# Altium project Face_HM1V0.PrjPCB
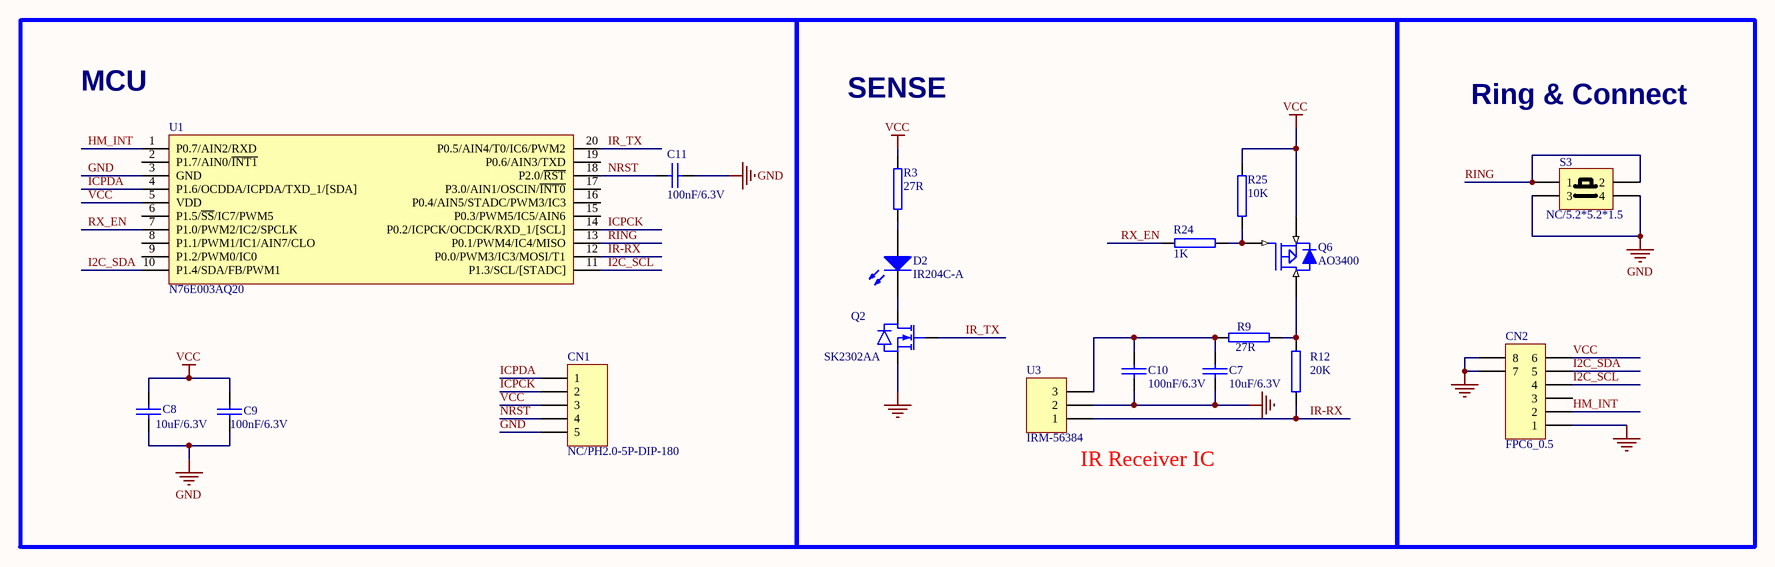
[diagram p0: Face_HM1V0.SchDoc]
1 sheet, 18 parts. Net scope: global (net labels, ports and power ports of the same name join across sheets).
Board file: Face_HM1V0.PcbDoc

## Sheet Face_HM1V0.SchDoc
size A3

### Parts
C7  10uf ±10% 6.3V X7R 0603 ROSH ROHS  [C0603]  (value not drawn)
C8  10uf ±10% 6.3V X7R 0603 ROSH ROHS  [C0603]  (value not drawn)
C9  100nF/6.3V 10% 0402 X7R ROHS  [C0402]  (value not drawn)
C10  100nF/6.3V 10% 0402 X7R ROHS  [C0402]  (value not drawn)
C11  100nF/6.3V 10% 0402 X7R ROHS  [C0402]  (value not drawn)
CN1  name1: NC/PH2.0-5P-DIP-180  [HD2.0_5P]  (hidden comment: NC/Header)
CN2  FPC6_0.5  [FPC0.5_6P_STRAIGHT]
D2  IR204C-A  [LD5.0_1 - duplicate]
Q2  SK2302AA  [SOT-23-3]
Q6  AO3400  [SOT-23-3]
R3  27R 5% 1/16W 0402 ROHS  [R0402]  (value not drawn)
R9  27R 5% 1/16W 0402 ROHS  [R0402]  (value not drawn)
R12  20K 5% 1/16W 0402 ROHS  [R0402]  (value not drawn)
R24  1K 5% 1/16W 0402 ROHS  [R0402]  (value not drawn)
R25  10K 5% 1/16W 0402 ROHS  [R0402]  (value not drawn)
S3  NC/5.2*5.2*1.5  [5.2X5.2X1.5 TACT SWITCH]
U1  N76E003AQ20(QFN20)  [QFN20_3*3mm]  (value not drawn)
U3  IRM-56384  [IRM-3638 - duplicate]

### Blocks framed on the sheet
MCU: C8 C9 C11 CN1 U1
SENSE: C7 C10 D2 Q2 Q6 R3 R9 R12 R24 R25 U3
Ring & Connect: CN2 S3

### Nets
GND: C7.2 C8.2 C9.2 C10.2 C11.2 CN1.5 CN2.1 CN2.7 CN2.8 Q2.2(S) S3.3 S3.4 U1.3(GND) U3.2
VCC: C8.1 C9.1 CN1.3 CN2.6 Q6.2(S) R3.1 R25.2 U1.5(VDD)
HM_INT: CN2.2 U1.1(P0.7/AIN2/RXD)
I2C_SCL: CN2.4 U1.11(P1.3/SCL/[STADC])
I2C_SDA: CN2.5 U1.10(P1.4/SDA/FB/PWM1)
ICPCK: CN1.2 U1.14(P0.2/ICPCK/OCDCK/RXD_1/[SCL])
ICPDA: CN1.1 U1.4(P1.6/OCDDA/ICPDA/TXD_1/[SDA])
IR-RX: R12.2 U1.12(P0.0/PWM3/IC3/MOSI/T1) U3.1
IR_TX: Q2.1(G) U1.20(P0.5/AIN4/T0/IC6/PWM2)
NRST: C11.1 CN1.4 U1.18(P2.0/~{RST})
RING: S3.1 S3.2 U1.13(P0.1/PWM4/IC4/MISO)
RX_EN: R24.1 U1.7(P1.0/PWM2/IC2/SPCLK)
NetC7_1: C7.1 C10.1 R9.2 U3.3
NetD2_A: D2.A R3.2
NetD2_K: D2.K Q2.3(D)
NetQ6_1: Q6.1(G) R24.2 R25.1
NetQ6_3: Q6.3(D) R9.1 R12.1

Not connected (* = marked no-connect by the designer): CN2 3; U1 2(P1.7/AIN0/~{INT1}) 6(P1.5/~{SS}/IC7/PWM5) 8(P1.1/PWM1/IC1/AIN7/CLO) 9(P1.2/PWM0/IC0) 15(P0.3/PWM5/IC5/AIN6) 16(P0.4/AIN5/STADC/PWM3/IC3) 17(P3.0/AIN1/OSCIN/~{INT0}) 19(P0.6/AIN3/TXD)

### Notes on the sheet
- (near U3) IR Receiver IC
- Title
- Size:
- Date:
- A3
- Time:
- Number:
- Revision:
- Sheet
- of
- File:
- (in symbol CAP) 100nF/6.3V; 10uF/6.3V
- (in symbol RES2) 27R; 20K; 1K; 10K

### Library data of the parts
C7 C8 = CAP: 10uf ±10% 6.3V X7R 0603 ROHS
C9-C11 = CAP
CN1 = Header5: Header ,5pin; 物料编号: ECZ02035; 名称: 弯针插座; 规格，型号: PH 2Pin 间距2.0mm DIP/90°; Parameter 1: PH2.0-5P-SMD-Top; Parameter 2: PH2.0-5P-SMD-Side
CN2 = Header 6
D2 = LED0
Q2 = MOSFET-N: StockNumber: *
Q6 = IRLML6402
R3 R9 R12 R24 R25 = RES2
S3 = Tactile Switch KEY6x6: LatestRevisionDate: 17-Jul-2002; LatestRevisionNote: Re-released for DXP Platform.; Publisher: Altium Limited
U1 = N76E003AQ20: 物料编号: EIC00048; 名称: IC; 规格，型号: STM8S003F3 (TSSOP20)
U3 = Header 3